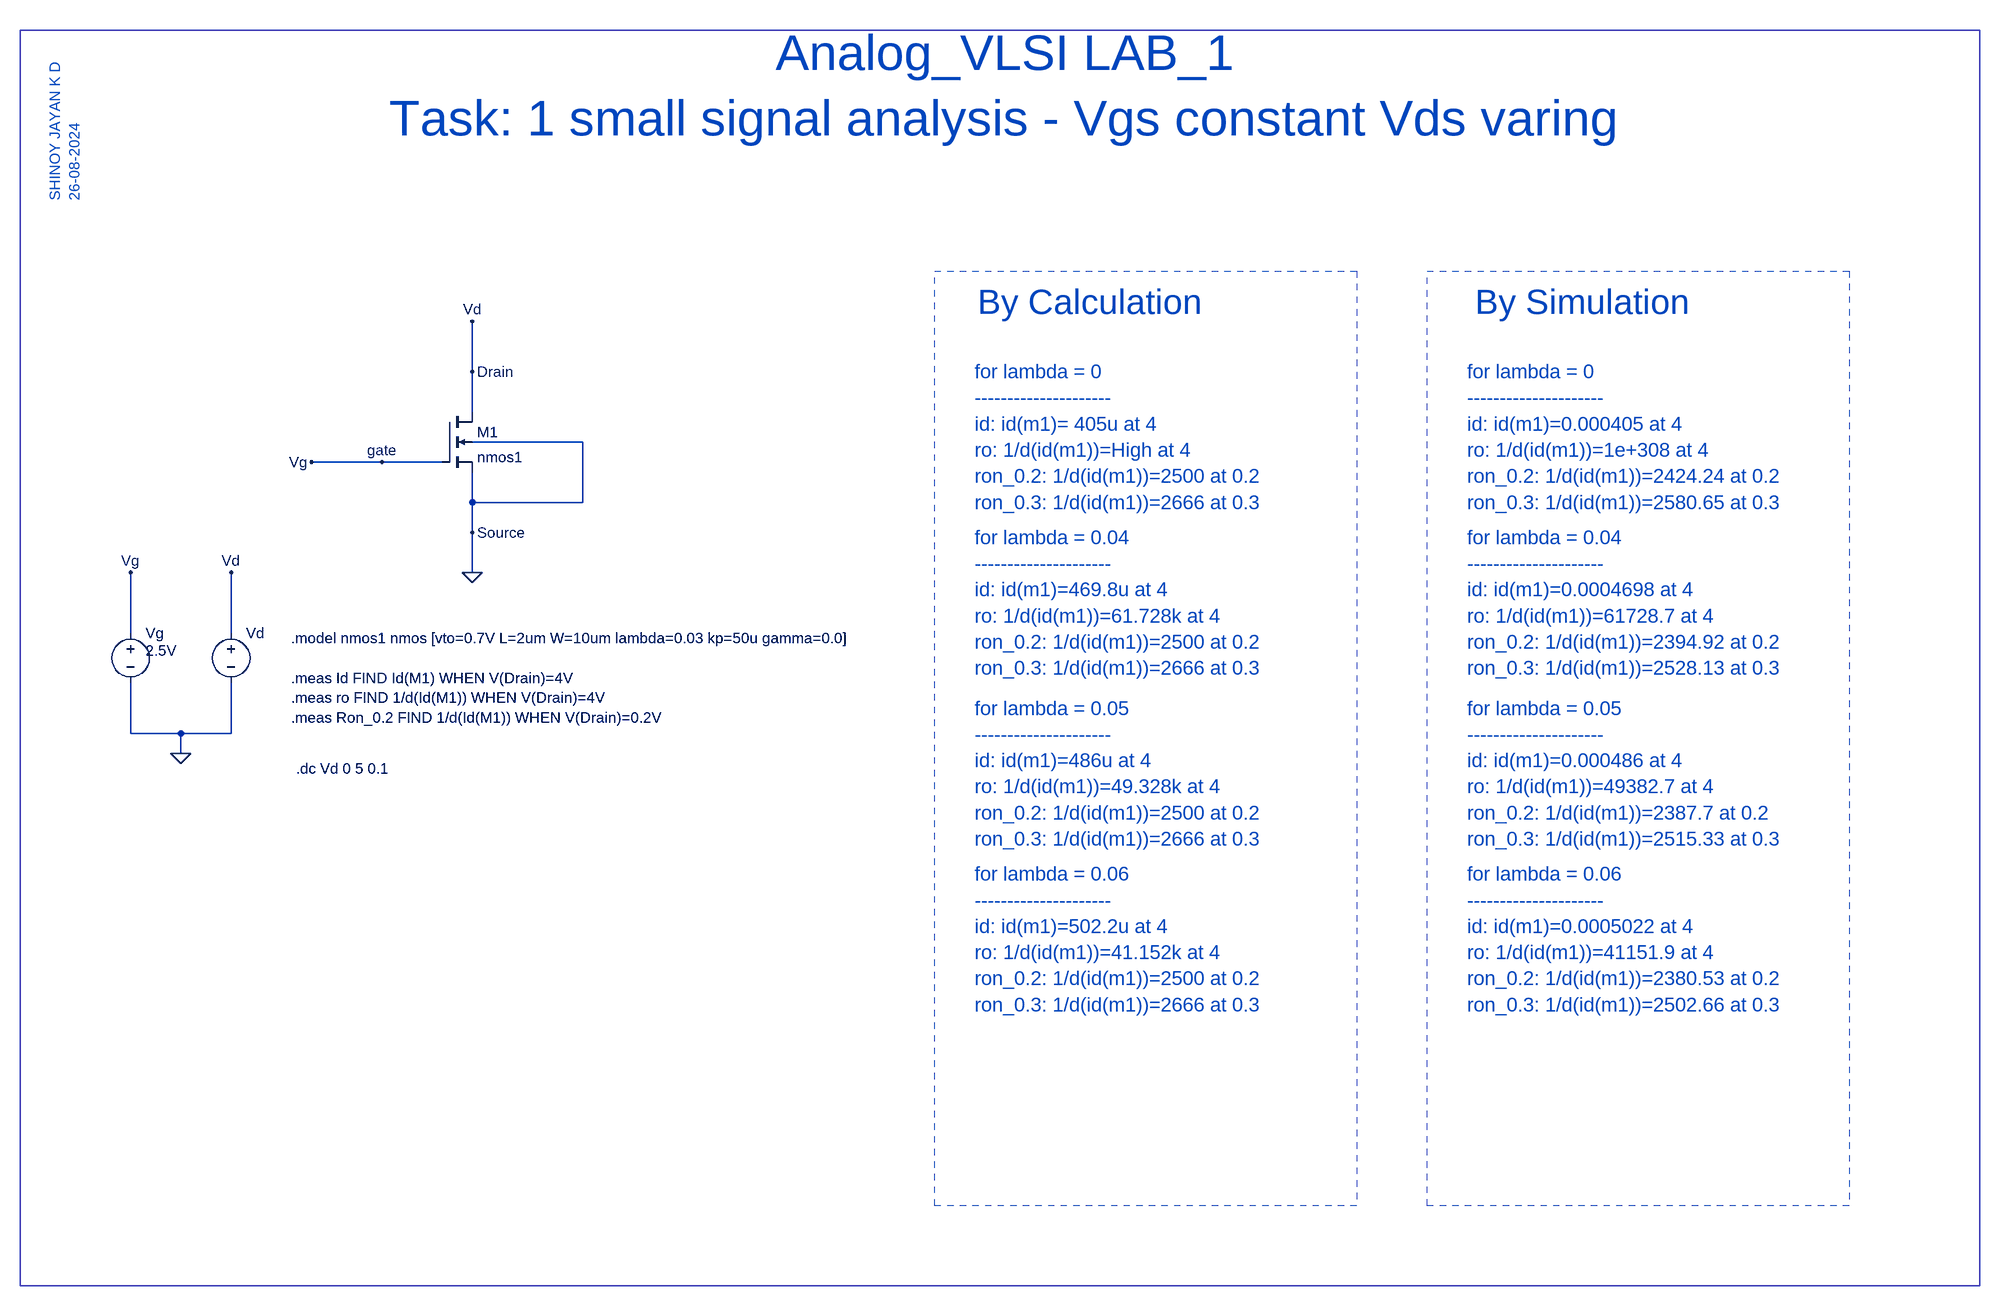
[diagram p0: schematic AVLSI_LAB_1_mosfet_charactristics_basic.asc]
AVLSI_LAB_1_mosfet_charactristics_basic.asc, the LTspice schematic file:
Version 4
SHEET 1 2788 1036
WIRE 48 -704 48 -784
WIRE 48 -640 48 -704
WIRE 224 -592 48 -592
WIRE -96 -560 -208 -560
WIRE 0 -560 -96 -560
WIRE 48 -496 48 -544
WIRE 224 -496 224 -592
WIRE 224 -496 48 -496
WIRE 48 -448 48 -496
WIRE 48 -384 48 -448
WIRE -496 -288 -496 -384
WIRE -336 -288 -336 -384
WIRE -496 -128 -496 -208
WIRE -416 -128 -496 -128
WIRE -336 -128 -336 -208
WIRE -336 -128 -416 -128
WIRE -416 -96 -416 -128
FLAG -416 -96 0
FLAG -496 -384 Vg
FLAG -336 -384 Vd
FLAG -208 -560 Vg
FLAG 48 -784 Vd
FLAG 48 -384 0
FLAG -96 -560 gate
FLAG 48 -704 Drain
FLAG 48 -448 Source
SYMBOL voltage -336 -304 R0
WINDOW 123 0 0 Left 0
WINDOW 39 0 0 Left 0
WINDOW 3 24 44 Left 2
SYMATTR Value ""
SYMATTR InstName Vd
SYMBOL voltage -496 -304 R0
WINDOW 123 0 0 Left 0
WINDOW 39 0 0 Left 0
WINDOW 3 24 44 Left 2
SYMATTR Value 2.5V
SYMATTR InstName Vg
SYMBOL nmos4 0 -640 R0
SYMATTR InstName M1
SYMATTR Value nmos1
TEXT 896 -1160 Center 6 ;Analog_VLSI LAB_1\nTask: 1 small signal analysis - Vgs constant Vds varing
TEXT -240 -280 Left 2 !.model nmos1 nmos [vto=0.7V L=2um W=10um lambda=0.03 kp=50u gamma=0.0]
TEXT -232 -72 Left 2 !.dc Vd 0 5 0.1
TEXT -240 -216 Left 2 !.meas Id FIND Id(M1) WHEN V(Drain)=4V\n.meas ro FIND 1/d(Id(M1)) WHEN V(Drain)=4V\n.meas Ron_0.2 FIND 1/d(Id(M1)) WHEN V(Drain)=0.2V
TEXT 1816 -816 Center 5 ;By Simulation
TEXT 1632 -704 Left 3 ;for lambda = 0\n---------------------\nid: id(m1)=0.000405 at 4\nro: 1/d(id(m1))=1e+308 at 4\nron_0.2: 1/d(id(m1))=2424.24 at 0.2\nron_0.3: 1/d(id(m1))=2580.65 at 0.3
TEXT 1632 -440 Left 3 ;for lambda = 0.04\n---------------------\nid: id(m1)=0.0004698 at 4\nro: 1/d(id(m1))=61728.7 at 4\nron_0.2: 1/d(id(m1))=2394.92 at 0.2\nron_0.3: 1/d(id(m1))=2528.13 at 0.3
TEXT 1632 -168 Left 3 ;for lambda = 0.05\n---------------------\nid: id(m1)=0.000486 at 4\nro: 1/d(id(m1))=49382.7 at 4\nron_0.2: 1/d(id(m1))=2387.7 at 0.2\nron_0.3: 1/d(id(m1))=2515.33 at 0.3
TEXT 1632 96 Left 3 ;for lambda = 0.06\n---------------------\nid: id(m1)=0.0005022 at 4\nro: 1/d(id(m1))=41151.9 at 4\nron_0.2: 1/d(id(m1))=2380.53 at 0.2\nron_0.3: 1/d(id(m1))=2502.66 at 0.3
TEXT 1032 -816 Center 5 ;By Calculation
TEXT 848 -704 Left 3 ;for lambda = 0\n---------------------\nid: id(m1)= 405u at 4\nro: 1/d(id(m1))=High at 4\nron_0.2: 1/d(id(m1))=2500 at 0.2\nron_0.3: 1/d(id(m1))=2666 at 0.3
TEXT 848 -440 Left 3 ;for lambda = 0.04\n---------------------\nid: id(m1)=469.8u at 4\nro: 1/d(id(m1))=61.728k at 4\nron_0.2: 1/d(id(m1))=2500 at 0.2\nron_0.3: 1/d(id(m1))=2666 at 0.3
TEXT 848 -168 Left 3 ;for lambda = 0.05\n---------------------\nid: id(m1)=486u at 4\nro: 1/d(id(m1))=49.328k at 4\nron_0.2: 1/d(id(m1))=2500 at 0.2\nron_0.3: 1/d(id(m1))=2666 at 0.3
TEXT 848 96 Left 3 ;for lambda = 0.06\n---------------------\nid: id(m1)=502.2u at 4\nro: 1/d(id(m1))=41.152k at 4\nron_0.2: 1/d(id(m1))=2500 at 0.2\nron_0.3: 1/d(id(m1))=2666 at 0.3
TEXT -616 -976 VLeft 2 ;SHINOY JAYAN K D\n26-08-2024
RECTANGLE Normal 2240 624 1568 -864 1
RECTANGLE Normal 1456 624 784 -864 1
RECTANGLE Normal 2448 752 -672 -1248

The netlist it stands for:
* AVLSI_LAB_1_mosfet_charactristics_basic.asc
Vd Drain 0
Vg gate 0 2.5V
M1 Drain gate 0 0 nmos1
.model NMOS NMOS
.model PMOS PMOS
.lib standard.mos
* Analog_VLSI LAB_1
* Task: 1 small signal analysis - Vgs constant Vds varing
.model nmos1 nmos [vto=0.7V L=2um W=10um lambda=0.03 kp=50u gamma=0.0]
.dc Vd 0 5 0.1
.meas Id FIND Id(M1) WHEN V(Drain)=4V
.meas ro FIND 1/d(Id(M1)) WHEN V(Drain)=4V
.meas Ron_0.2 FIND 1/d(Id(M1)) WHEN V(Drain)=0.2V
* By Simulation
* for lambda = 0
* ---------------------
* id: id(m1)=0.000405 at 4
* ro: 1/d(id(m1))=1e+308 at 4
* ron_0.2: 1/d(id(m1))=2424.24 at 0.2
* ron_0.3: 1/d(id(m1))=2580.65 at 0.3
* for lambda = 0.04
* ---------------------
* id: id(m1)=0.0004698 at 4
* ro: 1/d(id(m1))=61728.7 at 4
* ron_0.2: 1/d(id(m1))=2394.92 at 0.2
* ron_0.3: 1/d(id(m1))=2528.13 at 0.3
* for lambda = 0.05
* ---------------------
* id: id(m1)=0.000486 at 4
* ro: 1/d(id(m1))=49382.7 at 4
* ron_0.2: 1/d(id(m1))=2387.7 at 0.2
* ron_0.3: 1/d(id(m1))=2515.33 at 0.3
* for lambda = 0.06
* ---------------------
* id: id(m1)=0.0005022 at 4
* ro: 1/d(id(m1))=41151.9 at 4
* ron_0.2: 1/d(id(m1))=2380.53 at 0.2
* ron_0.3: 1/d(id(m1))=2502.66 at 0.3
* By Calculation
* for lambda = 0
* ---------------------
* id: id(m1)= 405u at 4
* ro: 1/d(id(m1))=High at 4
* ron_0.2: 1/d(id(m1))=2500 at 0.2
* ron_0.3: 1/d(id(m1))=2666 at 0.3
* for lambda = 0.04
* ---------------------
* id: id(m1)=469.8u at 4
* ro: 1/d(id(m1))=61.728k at 4
* ron_0.2: 1/d(id(m1))=2500 at 0.2
* ron_0.3: 1/d(id(m1))=2666 at 0.3
* for lambda = 0.05
* ---------------------
* id: id(m1)=486u at 4
* ro: 1/d(id(m1))=49.328k at 4
* ron_0.2: 1/d(id(m1))=2500 at 0.2
* ron_0.3: 1/d(id(m1))=2666 at 0.3
* for lambda = 0.06
* ---------------------
* id: id(m1)=502.2u at 4
* ro: 1/d(id(m1))=41.152k at 4
* ron_0.2: 1/d(id(m1))=2500 at 0.2
* ron_0.3: 1/d(id(m1))=2666 at 0.3
* SHINOY JAYAN K D
* 26-08-2024
.backanno
.end

* Results of the author's LTspice run, read from the files saved beside the schematic
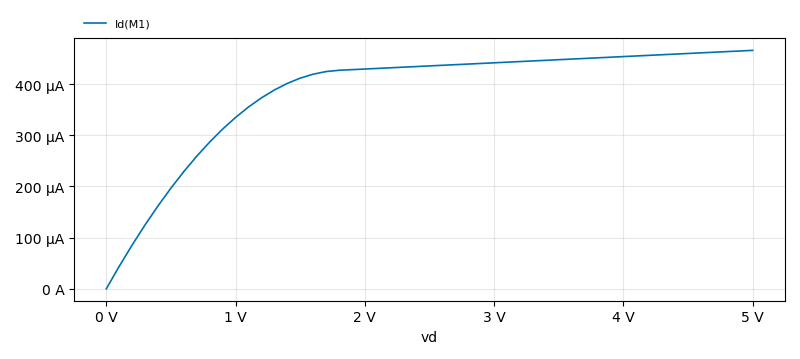
[diagram p1: DC transfer characteristic of AVLSI_LAB_1_mosfet_charactristics_basic.asc, plotted from the saved traces]
* DC transfer characteristic, 1 run:
*   Id(M1): 0 A at vd=0 V, 465.7 µA at vd=5 V, min 0 A, max 465.7 µA
* From the log:
*   id: id(m1)=0.0004536 at 4
*   ro: 1/d(id(m1))=82304.7 at 4
*   ron_0.2: 1/d(id(m1))=2402.19 at 0.2